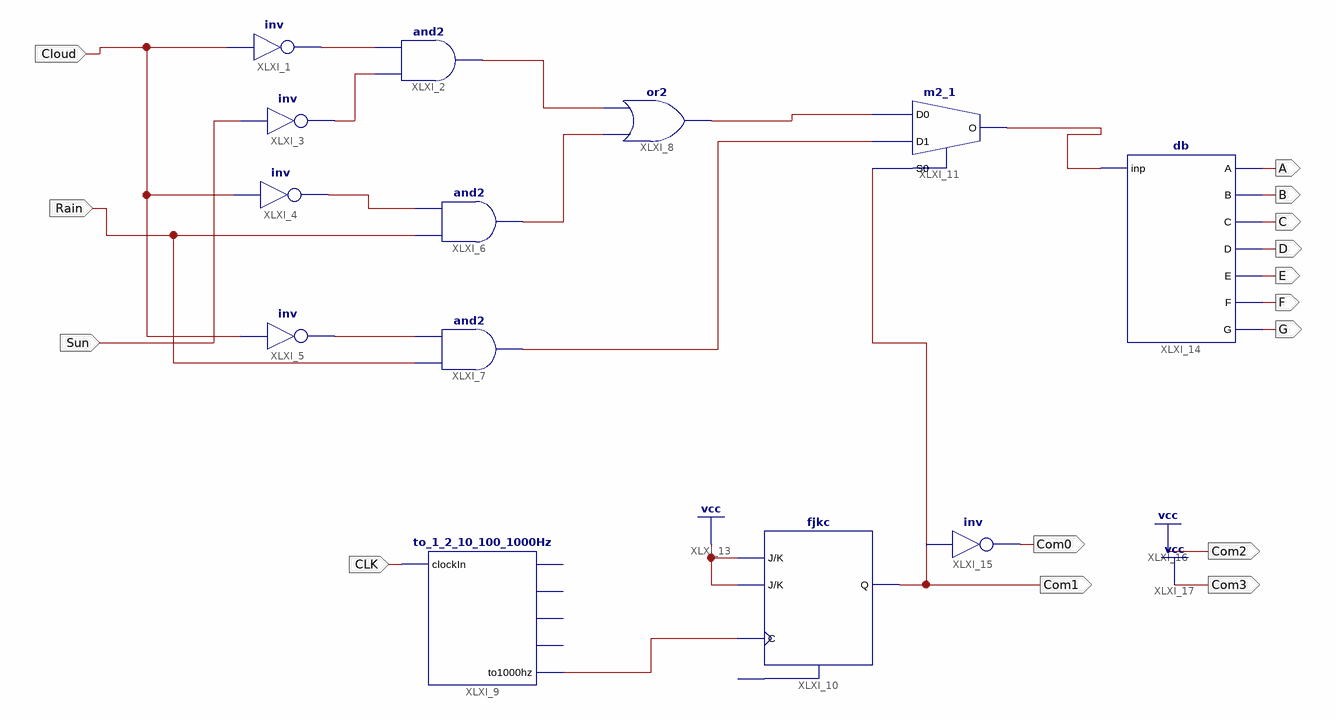
[diagram p0: schematic sheet 1]
// Xilinx ISE schematic main.sch (spartan6) as structural Verilog: 13 symbols, 15 ports
module main (
  input  Cloud,
  input  Rain,
  input  Sun,
  input  CLK,
  output Com1,
  output Com0,
  output Com2,
  output Com3,
  output C,
  output D,
  output E,
  output G,
  output B,
  output A,
  output F
);

  wire XLXN_1, XLXN_2, XLXN_11, XLXN_13, XLXN_14, XLXN_15, XLXN_18, XLXN_19, XLXN_21, XLXN_23;

  not XLXI_1 (XLXN_1, Cloud);
  and XLXI_2 (XLXN_14, XLXN_2, XLXN_1);
  not XLXI_3 (XLXN_2, Sun);
  not XLXI_4 (XLXN_13, Cloud);
  not XLXI_5 (XLXN_11, Cloud);
  and XLXI_6 (XLXN_15, Rain, XLXN_13);
  and XLXI_7 (XLXN_19, Rain, XLXN_11);
  or XLXI_8 (XLXN_18, XLXN_15, XLXN_14);
  to_1_2_10_100_1000Hz XLXI_9 (.clockIn(CLK), .to1000hz(XLXN_21));  // open: to1hz, to2hz, to10hz, to100hz
  fjkc XLXI_10 (.C(XLXN_21), .J(1'b1), .K(1'b1), .Q(Com1));  // open: CLR
  m2_1 XLXI_11 (.D0(XLXN_18), .D1(XLXN_19), .S0(Com1), .O(XLXN_23));
  not XLXI_15 (Com0, Com1);
  db XLXI_14 (.A(A), .B(B), .C(C), .D(D), .E(E), .F(F), .G(G), .inp(XLXN_23));

  assign Com2 = 1'b1;
  assign Com3 = 1'b1;
endmodule
